# EAGLE schematic F360Proj (EAGLE 9.7.0)
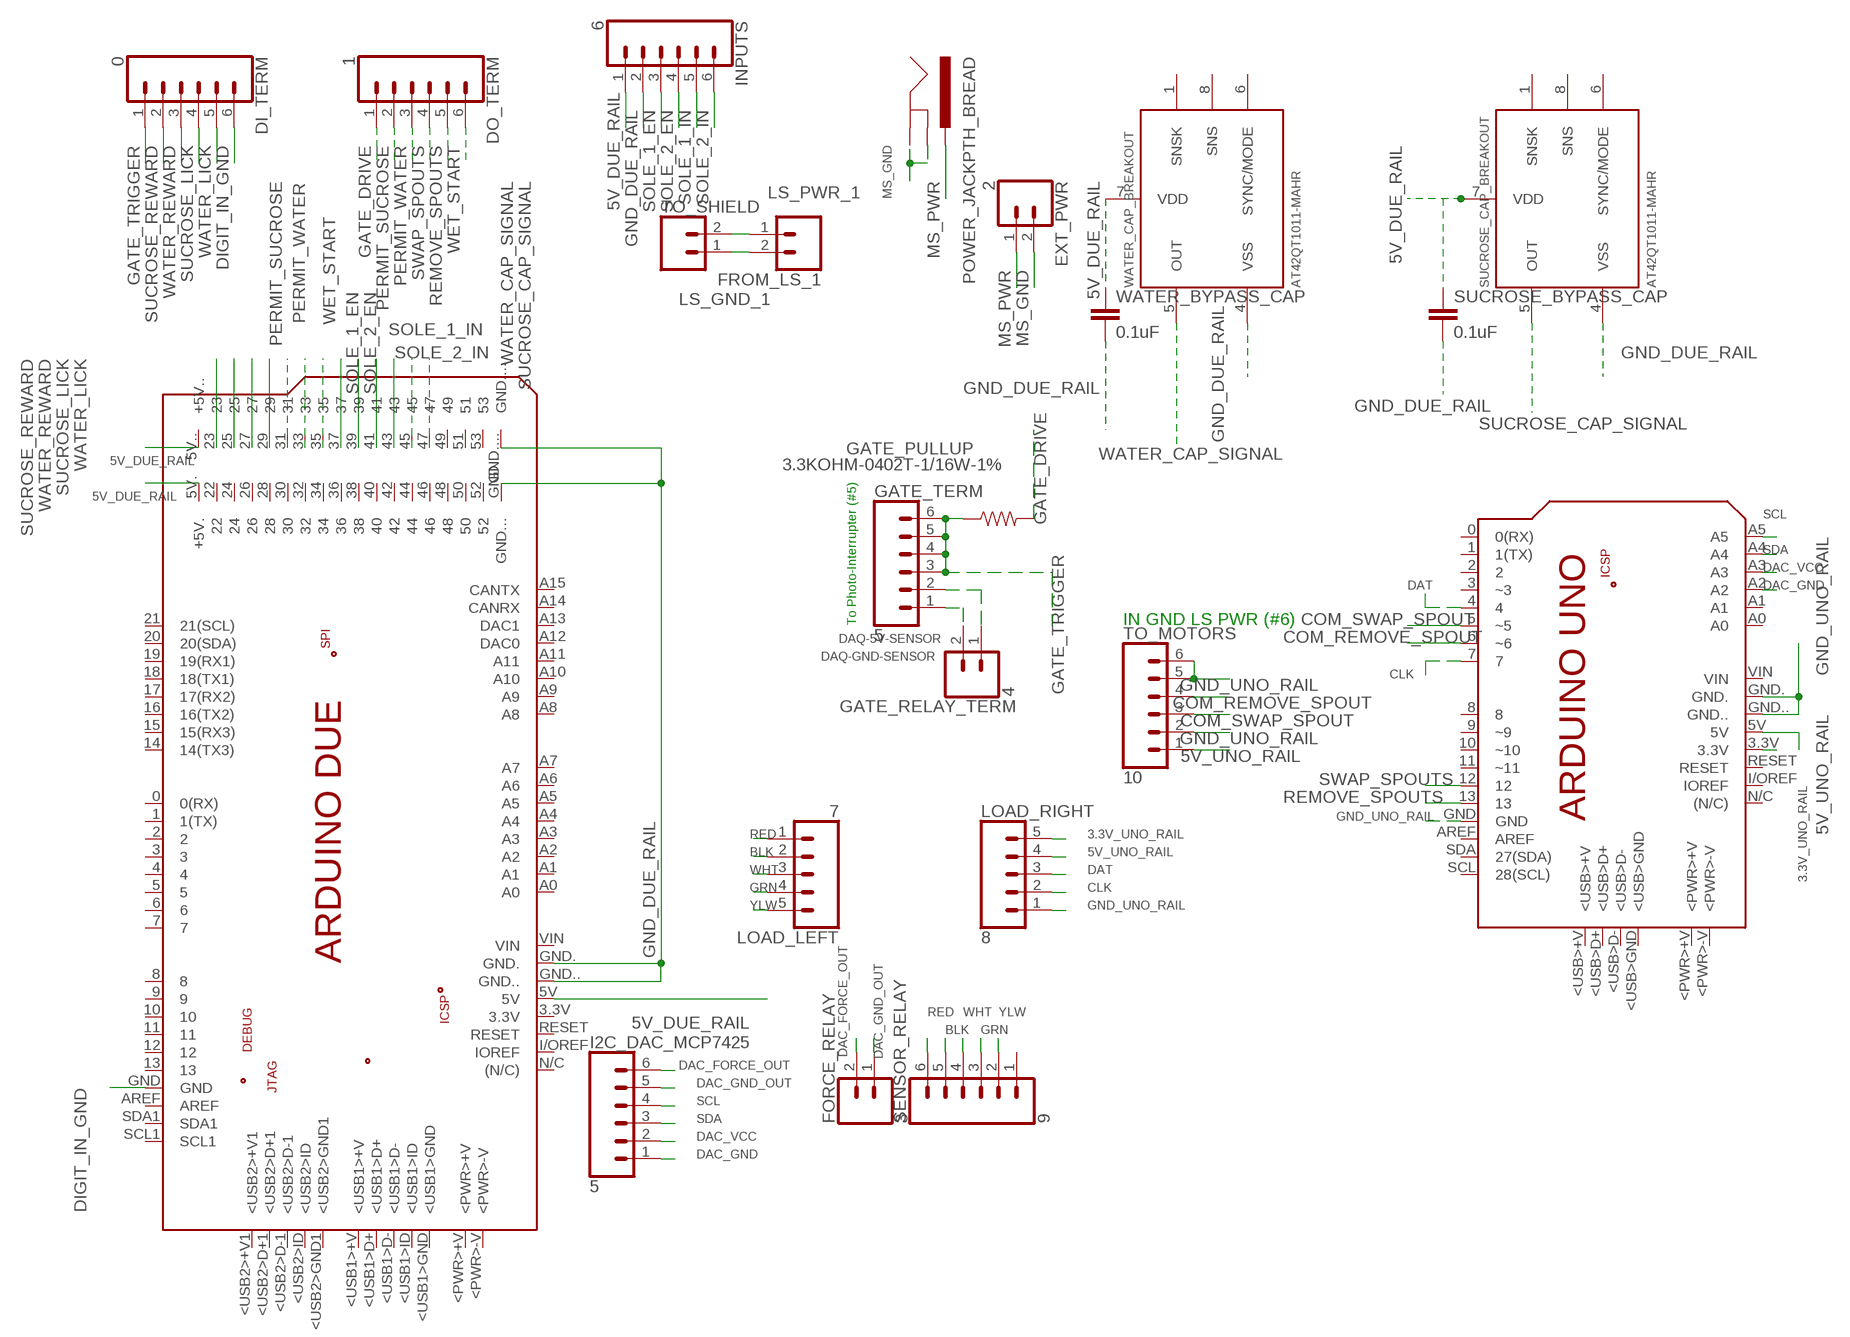
[diagram p0: schematic, sheet 1]

## Parts
DI_TERM  0  CONN_062.54MM_SCREW_TERMINALS  [1X06_2.54MM_SCREWPIN]
DO_TERM  1  CONN_062.54MM_SCREW_TERMINALS  [1X06_2.54MM_SCREWPIN]
EXT_PWR  2  CONN_02_1.5MM  [1X02_1.5MM_NO_SILK]
FORCE_RELAY  3  CONN_02_1.5MM  [1X02_1.5MM_NO_SILK]
FROM_LS_1  CONN_02_1.5MM  [1X02_1.5MM_NO_SILK]
GATE_PULLUP  3.3KOHM-0402T-1/16W-1%  [0402-TIGHT]
GATE_RELAY_TERM  4  CONN_02_1.5MM  [1X02_1.5MM_NO_SILK]
GATE_TERM  5  CONN_062.54MM_SCREW_TERMINALS  [1X06_2.54MM_SCREWPIN]
I2C_DAC_MCP7425  5  CONN_061.27MM  [1X06_1.27MM]
INPUTS  6  CONN_062.54MM_SCREW_TERMINALS  [1X06_2.54MM_SCREWPIN]
LOAD_LEFT  7  CONN_051.27MM  [1X05_1.27MM]
LOAD_RIGHT  8  CONN_051.27MM  [1X05_1.27MM]
MOTOR_SHIELD_PWR_JACK  POWER_JACKPTH_BREAD  [POWER_JACK_PTH_BREAD]
MOTORS_UNO  ARDUINO_UNO  [ARDUINO_UNO]
REWARDS_DUE  ARDUINO_DUE  [ARDUINO_DUE]
SENSOR_RELAY  9  CONN_062.54MM_SCREW_TERMINALS  [1X06_2.54MM_SCREWPIN]
SUCROSE_BYPASS_CAP  0.1uF  0.1UF-0402T-10V-10%-X7R  [0402-TIGHT]
SUCROSE_CAP_BREAKOUT  AT42QT1011-MAHR  AT42QT1011UDFN  [UDFN/USON_8_PAD]
TO_MOTORS  10  CONN_062.54MM_SCREW_TERMINALS  [1X06_2.54MM_SCREWPIN]
TO_SHIELD  CONN_02_1.5MM  [1X02_1.5MM_NO_SILK]
WATER_BYPASS_CAP  0.1uF  0.1UF-0402T-10V-10%-X7R  [0402-TIGHT]
WATER_CAP_BREAKOUT  AT42QT1011-MAHR  AT42QT1011UDFN  [UDFN/USON_8_PAD]

## Nets
3.3V_UNO_RAIL: LOAD_RIGHT.5 MOTORS_UNO.3.3V
5V_DUE_RAIL: INPUTS.1 REWARDS_DUE.5V REWARDS_DUE.5V.(+5V.) REWARDS_DUE.5V..(+5V..) SUCROSE_BYPASS_CAP.1 SUCROSE_CAP_BREAKOUT.7(VDD) WATER_BYPASS_CAP.1 WATER_CAP_BREAKOUT.7(VDD)
5V_UNO_RAIL: LOAD_RIGHT.4 MOTORS_UNO.5V TO_MOTORS.1
BLK: LOAD_LEFT.2 SENSOR_RELAY.5
CLK: LOAD_RIGHT.2 MOTORS_UNO.7
COM_REMOVE_SPOUT: MOTORS_UNO.6(~6) TO_MOTORS.4
COM_SWAP_SPOUT: MOTORS_UNO.5(~5) TO_MOTORS.3
DAC_FORCE_OUT: FORCE_RELAY.2 I2C_DAC_MCP7425.6
DAC_GND: I2C_DAC_MCP7425.1 MOTORS_UNO.A2
DAC_GND_OUT: FORCE_RELAY.1 I2C_DAC_MCP7425.5
DAC_VCC: I2C_DAC_MCP7425.2 MOTORS_UNO.A3
DAQ-5V-SENSOR: GATE_RELAY_TERM.2 GATE_TERM.1
DAQ-GND-SENSOR: GATE_RELAY_TERM.1 GATE_TERM.2
DAT: LOAD_RIGHT.3 MOTORS_UNO.4
DIGIT_IN_GND: DI_TERM.6 REWARDS_DUE.GND
GATE_DRIVE: DO_TERM.1 GATE_PULLUP.2
GATE_TRIGGER: DI_TERM.1 GATE_PULLUP.1 GATE_TERM.3 GATE_TERM.4 GATE_TERM.5 GATE_TERM.6
GND_DUE_RAIL: INPUTS.2 REWARDS_DUE.GND. REWARDS_DUE.GND.. REWARDS_DUE.GND... REWARDS_DUE.GND.... SUCROSE_BYPASS_CAP.2 SUCROSE_CAP_BREAKOUT.4(VSS) WATER_BYPASS_CAP.2 WATER_CAP_BREAKOUT.4(VSS)
GND_UNO_RAIL: LOAD_RIGHT.1 MOTORS_UNO.GND MOTORS_UNO.GND. MOTORS_UNO.GND.. TO_MOTORS.2 TO_MOTORS.5 TO_MOTORS.6
GRN: LOAD_LEFT.4 SENSOR_RELAY.3
LS_GND_1: FROM_LS_1.2 TO_SHIELD.1
LS_PWR_1: FROM_LS_1.1 TO_SHIELD.2
MS_GND: EXT_PWR.2 MOTOR_SHIELD_PWR_JACK.GND MOTOR_SHIELD_PWR_JACK.GNDBREAK
MS_PWR: EXT_PWR.1 MOTOR_SHIELD_PWR_JACK.PWR
PERMIT_SUCROSE: DO_TERM.2 REWARDS_DUE.31
PERMIT_WATER: DO_TERM.3 REWARDS_DUE.33
RED: LOAD_LEFT.1 SENSOR_RELAY.6
REMOVE_SPOUTS: DO_TERM.5 MOTORS_UNO.13
SCL: I2C_DAC_MCP7425.4 MOTORS_UNO.A5
SDA: I2C_DAC_MCP7425.3 MOTORS_UNO.A4
SOLE_1_EN: INPUTS.3 REWARDS_DUE.37
SOLE_1_IN: INPUTS.5 REWARDS_DUE.41
SOLE_2_EN: INPUTS.4 REWARDS_DUE.39
SOLE_2_IN: INPUTS.6 REWARDS_DUE.43
SUCROSE_CAP_SIGNAL: REWARDS_DUE.47 SUCROSE_CAP_BREAKOUT.5(OUT)
SUCROSE_LICK: DI_TERM.4 REWARDS_DUE.27
SUCROSE_REWARD: DI_TERM.2 REWARDS_DUE.23
SWAP_SPOUTS: DO_TERM.4 MOTORS_UNO.12
WATER_CAP_SIGNAL: REWARDS_DUE.45 WATER_CAP_BREAKOUT.5(OUT)
WATER_LICK: DI_TERM.5 REWARDS_DUE.29
WATER_REWARD: DI_TERM.3 REWARDS_DUE.25
WET_START: DO_TERM.6 REWARDS_DUE.35
WHT: LOAD_LEFT.3 SENSOR_RELAY.4
YLW: LOAD_LEFT.5 SENSOR_RELAY.2
Unconnected: MOTORS_UNO.0(0(RX)) MOTORS_UNO.1(1(TX)) MOTORS_UNO.2 MOTORS_UNO.3(~3) MOTORS_UNO.8 MOTORS_UNO.9(~9) MOTORS_UNO.10(~10) MOTORS_UNO.11(~11) MOTORS_UNO.+5V MOTORS_UNO.<PWR>+V MOTORS_UNO.<PWR>-V MOTORS_UNO.<USB>+V MOTORS_UNO.<USB>D+ MOTORS_UNO.<USB>D- MOTORS_UNO.<USB>GND MOTORS_UNO.A0 MOTORS_UNO.A1 MOTORS_UNO.AREF MOTORS_UNO.GND_ MOTORS_UNO.I/OREF(IOREF) MOTORS_UNO.MISO MOTORS_UNO.MOSI MOTORS_UNO.N/C((N/C)) MOTORS_UNO.RESET MOTORS_UNO.RESET. MOTORS_UNO.SCK MOTORS_UNO.SCL(28(SCL)) MOTORS_UNO.SDA(27(SDA)) MOTORS_UNO.VIN REWARDS_DUE.0(0(RX)) REWARDS_DUE.1(1(TX)) REWARDS_DUE.2 REWARDS_DUE.3 REWARDS_DUE.3.3V REWARDS_DUE.4 REWARDS_DUE.5 REWARDS_DUE.6 REWARDS_DUE.7 REWARDS_DUE.8 REWARDS_DUE.9 REWARDS_DUE.10 REWARDS_DUE.11 REWARDS_DUE.12 REWARDS_DUE.13 REWARDS_DUE.14(14(TX3)) REWARDS_DUE.15(15(RX3)) REWARDS_DUE.16(16(TX2)) REWARDS_DUE.17(17(RX2)) REWARDS_DUE.18(18(TX1)) REWARDS_DUE.19(19(RX1)) REWARDS_DUE.20(20(SDA)) REWARDS_DUE.21(21(SCL)) REWARDS_DUE.22 REWARDS_DUE.24 REWARDS_DUE.26 REWARDS_DUE.28 REWARDS_DUE.30 REWARDS_DUE.32 REWARDS_DUE.34 REWARDS_DUE.36 REWARDS_DUE.38 REWARDS_DUE.40 REWARDS_DUE.42 REWARDS_DUE.44 REWARDS_DUE.46 REWARDS_DUE.48 REWARDS_DUE.49 REWARDS_DUE.50 REWARDS_DUE.51 REWARDS_DUE.52 REWARDS_DUE.53 REWARDS_DUE.+3.3V REWARDS_DUE.+5V REWARDS_DUE.+5V_ REWARDS_DUE.<PWR>+V REWARDS_DUE.<PWR>-V REWARDS_DUE.<USB1>+V REWARDS_DUE.<USB1>D+ REWARDS_DUE.<USB1>D- REWARDS_DUE.<USB1>GND REWARDS_DUE.<USB1>ID REWARDS_DUE.<USB2>+V1 REWARDS_DUE.<USB2>D+1 REWARDS_DUE.<USB2>D-1 REWARDS_DUE.<USB2>GND1 REWARDS_DUE.<USB2>ID REWARDS_DUE.A0 REWARDS_DUE.A1 REWARDS_DUE.A2 REWARDS_DUE.A3 REWARDS_DUE.A4 REWARDS_DUE.A5 REWARDS_DUE.A6 REWARDS_DUE.A7 REWARDS_DUE.A8 REWARDS_DUE.A9 REWARDS_DUE.A10 REWARDS_DUE.A11 REWARDS_DUE.A12(DAC0) REWARDS_DUE.A13(DAC1) REWARDS_DUE.A14(CANRX) REWARDS_DUE.A15(CANTX) REWARDS_DUE.AREF REWARDS_DUE.GND1 REWARDS_DUE.GND1. REWARDS_DUE.GND1.. REWARDS_DUE.GND1... REWARDS_DUE.GND_ REWARDS_DUE.GND__ REWARDS_DUE.I/OREF(IOREF) REWARDS_DUE.MISO REWARDS_DUE.MISO2 REWARDS_DUE.MOSI REWARDS_DUE.MOSI2 REWARDS_DUE.N/C((N/C)) REWARDS_DUE.N/C. REWARDS_DUE.RESET REWARDS_DUE.RESET2 REWARDS_DUE.RESET. REWARDS_DUE.RESET.. REWARDS_DUE.RESET_ REWARDS_DUE.SCK REWARDS_DUE.SCK2 REWARDS_DUE.SCL1 REWARDS_DUE.SDA1 REWARDS_DUE.SWCLK REWARDS_DUE.SWDIO REWARDS_DUE.TCK REWARDS_DUE.TDI REWARDS_DUE.TDO REWARDS_DUE.TMS REWARDS_DUE.VIN SENSOR_RELAY.1 SUCROSE_CAP_BREAKOUT.1(SNSK) SUCROSE_CAP_BREAKOUT.6(SYNC/MODE) SUCROSE_CAP_BREAKOUT.8(SNS) WATER_CAP_BREAKOUT.1(SNSK) WATER_CAP_BREAKOUT.6(SYNC/MODE) WATER_CAP_BREAKOUT.8(SNS)

## Notes on the sheet
- To Photo-Interrupter (#5) | IN GND LS PWR (#6)

## Library data of the parts
DI_TERM DO_TERM GATE_TERM INPUTS SENSOR_RELAY TO_MOTORS = SparkFun-Connectors:CONN_06: Multi connection point. Often used as Generic Header-pin footprint for 0.1 inch spaced/style header connections On any of the 0.1 inch spaced packages, you can populate with these: Break Away Headers - Straight <https://www.sparkfun.com/products/116> (PRT-00116) Break Away Male Headers - Right Angle <https://www.sparkfun.com/products/553> (PRT-00553) Female Headers <https://www.sparkfun.com/products/115> (PRT-00115) Break Away Headers - Machine Pin <https://www.sparkfun.com/products/117> (PRT-00117) Break Away Female Headers - Swiss Machine Pin <https://www.sparkfun.com/products/743> (PRT-00743) Arduino Stackable Header - 6 Pin <https://www.sparkfun.com/products/9280> (PRT-09280) Screw Terminals 2.54mm Pitch (6-Pin) <https://www.sparkfun.com/products/16499> (PRT-16499) For SCREWTERMINALS and SPRING TERMINALS visit here: Screw Terimnals on SparkFun.com <https://www.sparkfun.com/search/results?term=Screw+Terminals> (5mm/3.5mm/2.54mm spacing) This device is also useful as a general connection point to wire up your design to another part of your project. Our various solder wires solder well into these plated through hole pads. Hook-Up Wire - Assortment (Stranded, 22 AWG) <https://www.sparkfun.com/products/11375> (PRT-11375) Hook-Up Wire - Assortment (Solid Core, 22 AWG) <https://www.sparkfun.com/products/11367> (PRT-11367) View the entire wire category on our website here <https://www.sparkfun.com/categories/141>; PROD_ID: CONN-14885
EXT_PWR FORCE_RELAY FROM_LS_1 GATE_RELAY_TERM TO_SHIELD = SparkFun-Connectors:CONN_02: Multi connection point. Often used as Generic Header-pin footprint for 0.1 inch spaced/style header connections On any of the 0.1 inch spaced packages, you can populate with these: Break Away Headers - Straight <https://www.sparkfun.com/products/116> (PRT-00116) Break Away Male Headers - Right Angle <https://www.sparkfun.com/products/553> (PRT-00553) Female Headers <https://www.sparkfun.com/products/115> (PRT-00115) Break Away Headers - Machine Pin <https://www.sparkfun.com/products/117> (PRT-00117) Break Away Female Headers - Swiss Machine Pin <https://www.sparkfun.com/products/743> (PRT-00743) For SCREWTERMINALS and SPRING TERMINALS visit here: Screw Terimnals on SparkFun.com <https://www.sparkfun.com/search/results?term=Screw+Terminals> (5mm/3.5mm/2.54mm spacing) This device is also useful as a general connection point to wire up your design to another part of your project. Our various solder wires solder well into these plated through hole pads. Hook-Up Wire - Assortment (Stranded, 22 AWG) <https://www.sparkfun.com/products/11375> (PRT-11375) Hook-Up Wire - Assortment (Solid Core, 22 AWG) <https://www.sparkfun.com/products/11367> (PRT-11367) View the entire wire category on our website here <https://www.sparkfun.com/categories/141> Special notes: Molex polarized connector foot print use with: PRT-08233 with associated crimp pins and housings. 2.54_SCREWTERM for use with PRT-10571. 3.5mm Screw Terminal footprints for PRT-08084 5mm Screw Terminal footprints for use with PRT-08432
GATE_PULLUP = SparkFun-Resistors:3.3KOHM: 3.3kΩ resistor A resistor is a passive two-terminal electrical component that implements electrical resistance as a circuit element. Resistors act to reduce current flow, and, at the same time, act to lower voltage levels within circuits. - Wikipedia; PROD_ID: RES-15923
I2C_DAC_MCP7425 = SparkFun-Connectors:CONN_06: Multi connection point. Often used as Generic Header-pin footprint for 0.1 inch spaced/style header connections On any of the 0.1 inch spaced packages, you can populate with these: Break Away Headers - Straight <https://www.sparkfun.com/products/116> (PRT-00116) Break Away Male Headers - Right Angle <https://www.sparkfun.com/products/553> (PRT-00553) Female Headers <https://www.sparkfun.com/products/115> (PRT-00115) Break Away Headers - Machine Pin <https://www.sparkfun.com/products/117> (PRT-00117) Break Away Female Headers - Swiss Machine Pin <https://www.sparkfun.com/products/743> (PRT-00743) Arduino Stackable Header - 6 Pin <https://www.sparkfun.com/products/9280> (PRT-09280) Screw Terminals 2.54mm Pitch (6-Pin) <https://www.sparkfun.com/products/16499> (PRT-16499) For SCREWTERMINALS and SPRING TERMINALS visit here: Screw Terimnals on SparkFun.com <https://www.sparkfun.com/search/results?term=Screw+Terminals> (5mm/3.5mm/2.54mm spacing) This device is also useful as a general connection point to wire up your design to another part of your project. Our various solder wires solder well into these plated through hole pads. Hook-Up Wire - Assortment (Stranded, 22 AWG) <https://www.sparkfun.com/products/11375> (PRT-11375) Hook-Up Wire - Assortment (Solid Core, 22 AWG) <https://www.sparkfun.com/products/11367> (PRT-11367) View the entire wire category on our website here <https://www.sparkfun.com/categories/141>
LOAD_LEFT LOAD_RIGHT = SparkFun-Connectors:CONN_05: Multi connection point. Often used as Generic Header-pin footprint for 0.1 inch spaced/style header connections On any of the 0.1 inch spaced packages, you can populate with these: Break Away Headers - Straight <https://www.sparkfun.com/products/116> (PRT-00116) Break Away Male Headers - Right Angle <https://www.sparkfun.com/products/553> (PRT-00553) Female Headers <https://www.sparkfun.com/products/115> (PRT-00115) Break Away Headers - Machine Pin <https://www.sparkfun.com/products/117> (PRT-00117) Break Away Female Headers - Swiss Machine Pin <https://www.sparkfun.com/products/743> (PRT-00743) For SCREWTERMINALS and SPRING TERMINALS visit here: Screw Terimnals on SparkFun.com <https://www.sparkfun.com/search/results?term=Screw+Terminals> (5mm/3.5mm/2.54mm spacing) This device is also useful as a general connection point to wire up your design to another part of your project. Our various solder wires solder well into these plated through hole pads. Hook-Up Wire - Assortment (Stranded, 22 AWG) <https://www.sparkfun.com/products/11375> (PRT-11375) Hook-Up Wire - Assortment (Solid Core, 22 AWG) <https://www.sparkfun.com/products/11367> (PRT-11367) View the entire wire category on our website here <https://www.sparkfun.com/categories/141> Special notes: Molex polarized connector foot print use with SKU : PRT-08231 with associated crimp pins and housings. 1MM SMD Version SKU: PRT-10208
MOTOR_SHIELD_PWR_JACK = SparkFun-Connectors:POWER_JACK: Power Jack Connector This is the standard 5.5mm barrel jack for power. The PTH is the most common, proven, reliable, footprint. The Slot footprint only works if the mill layer is transmitted to the PCB fab house so be warned. Here are the connectors we sell at SparkFun: DC Barrel Power Jack/Connector <https://www.sparkfun.com/products/119> (PRT-00119) DC Barrel Power Jack/Connector (SMD) <https://www.sparkfun.com/products/12748> (PRT-12748) DC Barrel Jack Adapter - Breadboard Compatible <https://www.sparkfun.com/products/10811> (PRT-10811) It is used on this SparkFun product (and many, many others): SparkFun RedBoard - Programmed with Arduino <https://www.sparkfun.com/products/12757> (DEV-12757) Also, if you need a mating power supply or connector, please check these out: Wall Adapter Power Supply - 9VDC 650mA <https://www.sparkfun.com/products/298> (TOL-00298) DC Barrel Jack Adapter - Male <https://www.sparkfun.com/products/10287> (PRT-10287); PROD_ID: COMP-13253
MOTORS_UNO = UNO_NO_DIM:ARDUINO_UNO: Device for representing an Arduino Uno board with a footprint in an EAGLE design. Created by Dave Young for Element14. More EAGLE documentation at: http://www.element14.com/community/community/knode/cadsoft_eagle
REWARDS_DUE = DUE_NO_DIM:ARDUINO_DUE: Device for representing an Arduino Due board with a footprint in an EAGLE design. Created by Dave Young for Element14. More EAGLE documentation at: http://www.element14.com/community/community/knode/cadsoft_eagle
SUCROSE_BYPASS_CAP WATER_BYPASS_CAP = SparkFun-RF:0.1UF: 0.1µF ceramic capacitors A capacitor is a passive two-terminal electrical component used to store electrical energy temporarily in an electric field.; PROD_ID: CAP-15083
SUCROSE_CAP_BREAKOUT WATER_CAP_BREAKOUT = SparkFun-Sensors:AT42QT1011: Atmel AT42QT1011 The AT42QT1011 (QT1011) is a digital burst mode charge-transfer (QT™) sensor that is capable of detecting nearproximityor touch, making it ideal for implementing touch controls.The QT1011 is designed specifically for human interfaces, like control panels, appliances, toys, lighting controls, or anywhere a mechanical switch or button may be found. It includes all hardware and signal processing functions necessary to provide stable sensing under a wide variety of changing conditions. Only a single low-cost capacitor is required for operation. Datasheet <https://ww1.microchip.com/downloads/en/DeviceDoc/40001947A.pdf> Sparkfun Products Sparkfun Capacitive Touch Breakout <https://www.sparkfun.com/products/14520> (SEN-14520); PROD_ID: IC-13838

## Module FORCE
Ports: YLW(io) GRN(io) WHT(io) BLK(io) RED(io) VDD(io) VCC(io) DAT(io) CLK(io) GND(io)

### Library data of the parts